# Altium schematic sheet CELL_SENSE.SchDoc
size A; SheetNumber: 7; SheetTotal: 9
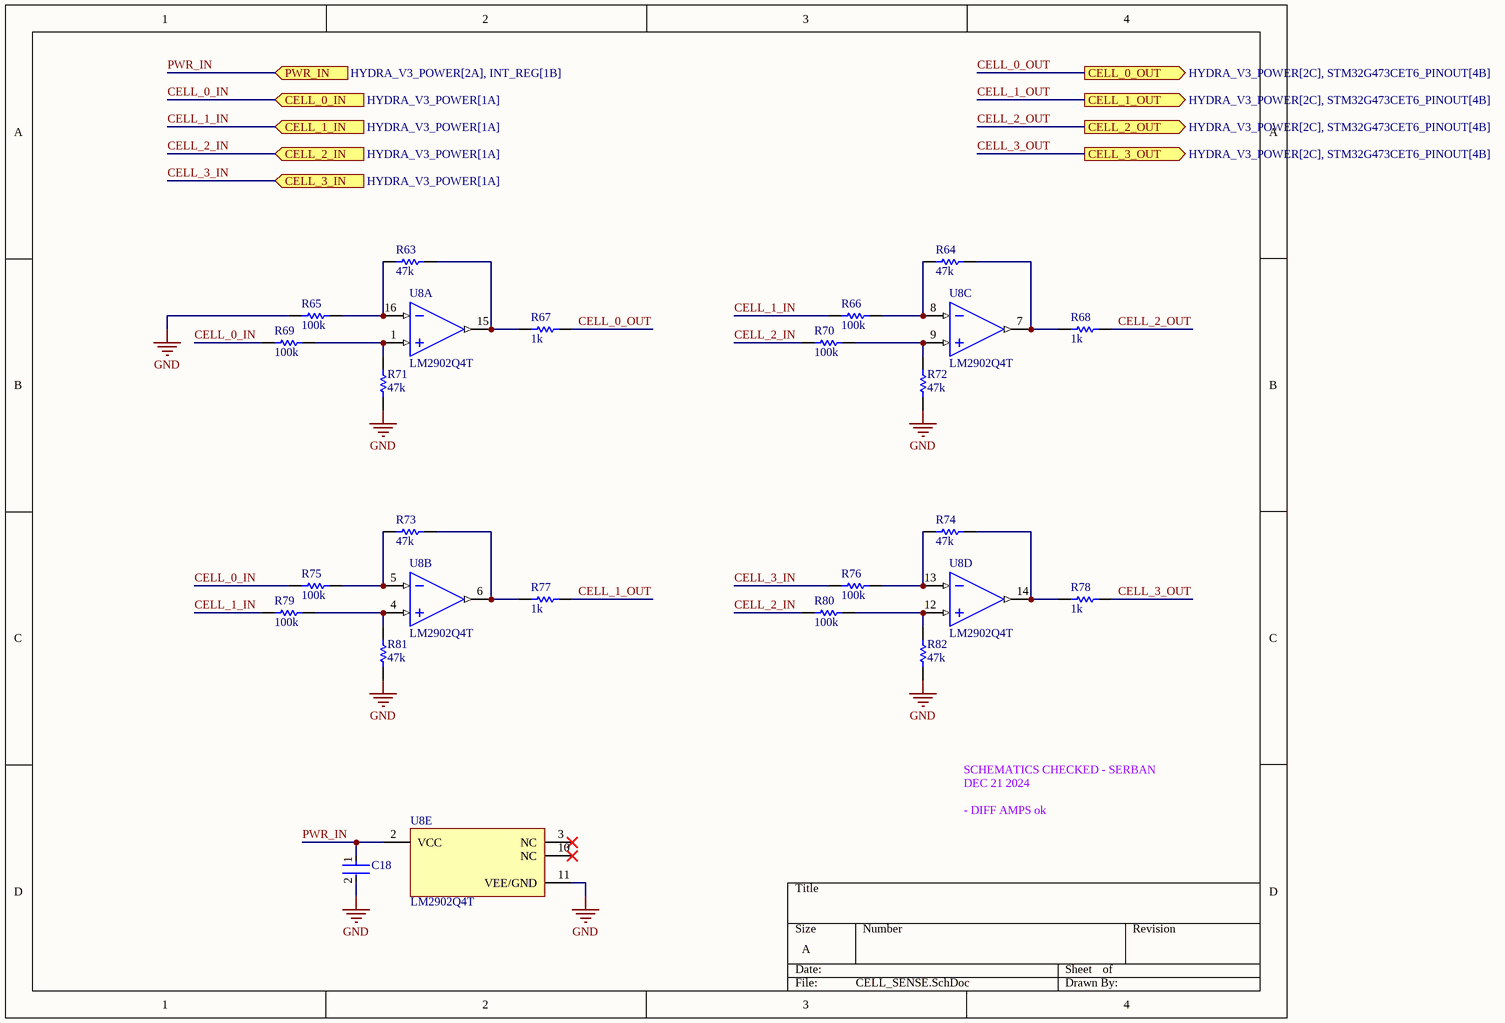
[diagram p0: CELL_SENSE.SchDoc]

## Parts
C18  100n  [FP-0402-L_1_0_0_05-W_0_5-IPC_A]  (value not drawn)
R63  47k  [R0603B]
R64  47k  [R0603B]
R65  100k  [R0603B]
R66  100k  [R0603B]
R67  1k  [R0603B]
R68  1k  [R0603B]
R69  100k  [R0603B]
R70  100k  [R0603B]
R71  47k  [R0603B]
R72  47k  [R0603B]
R73  47k  [R0603B]
R74  47k  [R0603B]
R75  100k  [R0603B]
R76  100k  [R0603B]
R77  1k  [R0603B]
R78  1k  [R0603B]
R79  100k  [R0603B]
R80  100k  [R0603B]
R81  47k  [R0603B]
R82  47k  [R0603B]
U8  LM2902Q4T  [QFN50P300X300X100_HS-17N]  (parts A,B,C,D,E of 5)

## Ports
CELL_0_IN (in, see HYDRA_V3_POWER[1A]), CELL_0_OUT (out, see HYDRA_V3_POWER[2C], STM32G473CET6_PINOUT[4B]), CELL_1_IN (in, see HYDRA_V3_POWER[1A]), CELL_1_OUT (out, see HYDRA_V3_POWER[2C], STM32G473CET6_PINOUT[4B]), CELL_2_IN (in, see HYDRA_V3_POWER[1A]), CELL_2_OUT (out, see HYDRA_V3_POWER[2C], STM32G473CET6_PINOUT[4B]), CELL_3_IN (in, see HYDRA_V3_POWER[1A]), CELL_3_OUT (out, see HYDRA_V3_POWER[2C], STM32G473CET6_PINOUT[4B]), PWR_IN (in, see HYDRA_V3_POWER[2A], INT_REG[1B])

## Nets
GND: C18.2 R65.2 R71.2 R72.2 R81.2 R82.2 U8.11(VEE/GND)
CELL_0_IN: R69.2 R75.2 ; port CELL_0_IN
CELL_0_OUT: R67.1 ; port CELL_0_OUT
CELL_1_IN: R66.2 R79.2 ; port CELL_1_IN
CELL_1_OUT: R77.1 ; port CELL_1_OUT
CELL_2_IN: R70.2 R80.2 ; port CELL_2_IN
CELL_2_OUT: R68.1 ; port CELL_2_OUT
CELL_3_IN: R76.2 ; port CELL_3_IN
CELL_3_OUT: R78.1 ; port CELL_3_OUT
PWR_IN: C18.1 U8.2(VCC) ; port PWR_IN
NetR63_1: R63.1 R65.1 U8.16(IN1-)
NetR63_2: R63.2 R67.2 U8.15(OUT1)
NetR64_1: R64.1 R66.1 U8.8(IN3-)
NetR64_2: R64.2 R68.2 U8.7(OUT3)
NetR69_1: R69.1 R71.1 U8.1(IN1+)
NetR70_1: R70.1 R72.1 U8.9(IN3+)
NetR73_1: R73.1 R75.1 U8.5(IN2-)
NetR73_2: R73.2 R77.2 U8.6(OUT2)
NetR74_1: R74.1 R76.1 U8.13(IN4-)
NetR74_2: R74.2 R78.2 U8.14(OUT4)
NetR79_1: R79.1 R81.1 U8.4(IN2+)
NetR80_1: R80.1 R82.1 U8.12(IN4+)

Not connected (* = marked no-connect by the designer): U8 3(NC)* 10(NC)*

## Notes on the sheet
- SCHEMATICS CHECKED - SERBAN
  DEC 21 2024
  - DIFF AMPS ok

## Library data of the parts
C18 = CMP-001-00058-1: LARGE PADS, 0402 CAP, CHANGE COMMENT TO MATCH REAL P/N; Capacitor Type: Ceramic; Min Operating Temperature: -55°C; Mounting Technology: Surface Mount; Pins: 2; Case/Package: 0402; RoHS Compliant: Yes; Max Operating Temperature: 85°C
R63-R82 = CMP-009-00002-14: Resistor
U8 = CMP-014-00021-1: Operational Amplifier, 4 Func, 9000uV Offset-Max, BIPolar, PQCC16; Channels: 4; RoHS Compliant: Yes; Max Operating Temperature: 125°C; Case/Package: HVQCCN; Pins: 16; Min Operating Temperature: -40°C